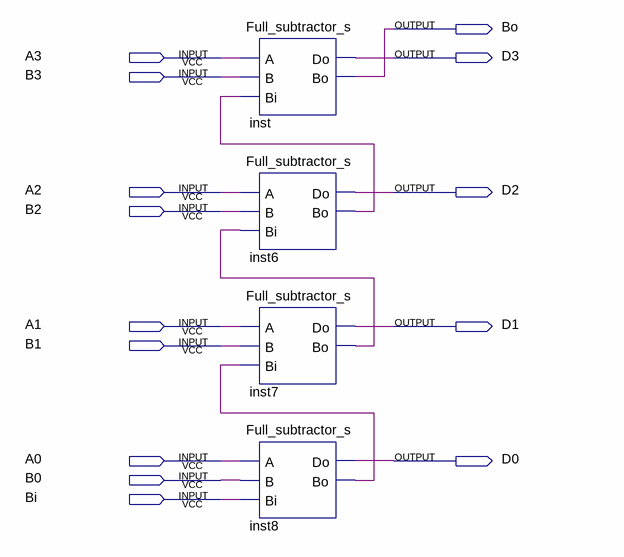
[diagram p0: schematic sheet]
// Quartus schematic 4bit_subtracor_G.bdf as structural Verilog: 4 symbols, 14 pins
module \4bit_subtracor_G  (
  input  A3,
  input  B3,
  input  A2,
  input  B2,
  input  A1,
  input  B1,
  input  A0,
  input  B0,
  input  Bi,
  output Bo,
  output D3,
  output D2,
  output D1,
  output D0
);

  wire inst6_bo, inst7_bo, inst8_bo;

  Full_subtractor_s inst (.A(A3), .B(B3), .Bi(inst6_bo), .Do(D3), .Bo(Bo));
  Full_subtractor_s inst6 (.A(A2), .B(B2), .Bi(inst7_bo), .Do(D2), .Bo(inst6_bo));
  Full_subtractor_s inst7 (.A(A1), .B(B1), .Bi(inst8_bo), .Do(D1), .Bo(inst7_bo));
  Full_subtractor_s inst8 (.A(A0), .B(B0), .Bi(Bi), .Do(D0), .Bo(inst8_bo));
endmodule
